# Altium schematic sheet Dimming.SchDoc
size B; Organization: MASA; SheetNumber: 7; SheetTotal: 7
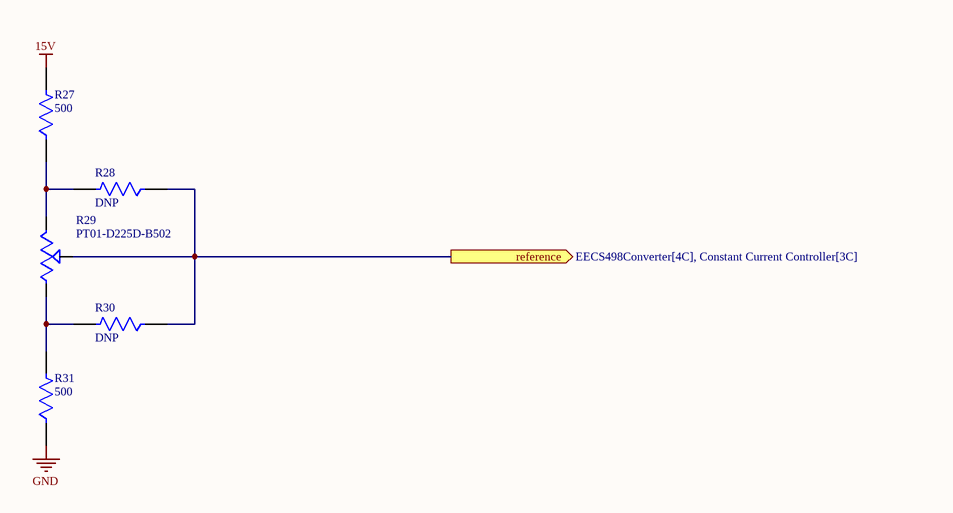
[diagram p0: Dimming.SchDoc]

## Parts
R27  500  [FP-RLR07-MFG]
R28  DNP  [FP-RLR07-MFG]
R29  PT01-D225D-B502  [TRIM_PT01-D225D-B502]
R30  DNP  [FP-RLR07-MFG]
R31  500  [FP-RLR07-MFG]

## Ports
reference (out, see EECS498Converter[4C], Constant Current Controller[3C])

## Nets
15V: R27.2
GND: R31.1
reference: R28.1 R29.2 R30.1 ; port reference
NetR27_1: R27.1 R28.2 R29.1
NetR29_3: R29.3 R30.2 R31.2

## Notes on the sheet
- Michigan Aeronautical Science Association
- University of Michigan, Ann Arbor
- Size: B

## Library data of the parts
R27 R28 R30 R31 = Resistor: Resistor, ± 1%, 250 mW, Axial Leaded, Metal Film, Military Reliability; NexarPartId: 39453770; Max Power Dissipation: 250mW; Resistance: 100kΩ; Lead Length: 38.1mm; Voltage Rating: 250V; Lead Diameter: 640µm; Temperature Coefficient: 100ppm/°C; Wire/Cable Diameter: 50.8µm; Military Standard: MIL-PRF-39017; REACH SVHC: Unknown; Min Operating Temperature: -65°C; Length: 7.62mm; Case/Package: Axial; Lead Free: Contains Lead; Height: 2.5mm; Contact Plating: Lead, Tin; Radiation Hardening: No; Composition: Metal Film; Voltage Rating (DC): 250V; Schedule B: 8533210090, 8533210090|8533210090, 8533210090|8533210090|8533210090, 8533210090|8533210090|8533210090|8533210090; Diameter: 2.29mm; Tolerance: 1%; Max Operating Temperature: 150°C; Number of Terminations: 2; RoHS: Non-Compliant; Features: Military, Moisture Resistant, Weldable; Power Rating: 250mW; Packaging: Bulk; Width: 2.29mm; Termination: Axial; Failure Rate: 0.001%
R29 = PT01-D225D-B502: Value: *; MP: PT01-D225D-B502; Availability: Unavailable; Package: None; Price: None